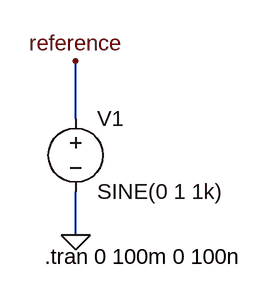
[diagram p0: schematic Draft ep6.asc]
Draft ep6.asc, the LTspice schematic file:
Version 4
SHEET 1 880 680
WIRE 176 128 176 64
WIRE 176 256 176 208
FLAG 176 256 0
FLAG 176 64 reference
SYMBOL voltage 176 112 R0
WINDOW 123 0 0 Left 0
WINDOW 39 0 0 Left 0
SYMATTR InstName V1
SYMATTR Value SINE(0 1 1k)
TEXT 142 280 Left 2 !.tran 0 100m 0 100n

The netlist it stands for:
* Draft ep6.asc
V1 reference 0 SINE(0 1 1k)
.tran 0 100m 0 100n
.backanno
.end

* Results of the author's LTspice run, read from the files saved beside the schematic
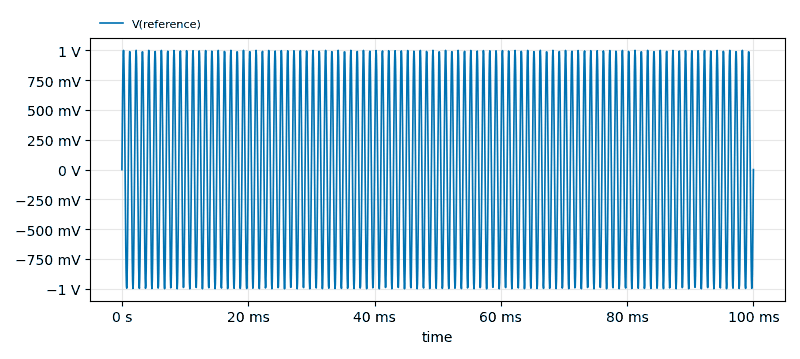
[diagram p1: Transient Analysis of Draft ep6.asc, plotted from the saved traces]
* Transient Analysis, 1 run:
*   V(reference): min -1 V, max 1 V, average -731.7 nV, rms 704.5 mV, last 0 V